# Altium schematic sheet IOExpander.SchDoc: I/O Expander
size Letter; ApprovedBy: Kevin Cotton; Author: Jessica Di Stefano; DrawnBy: Jessica Di Stefano; Revision: A; SheetNumber: 4; SheetTotal: 7
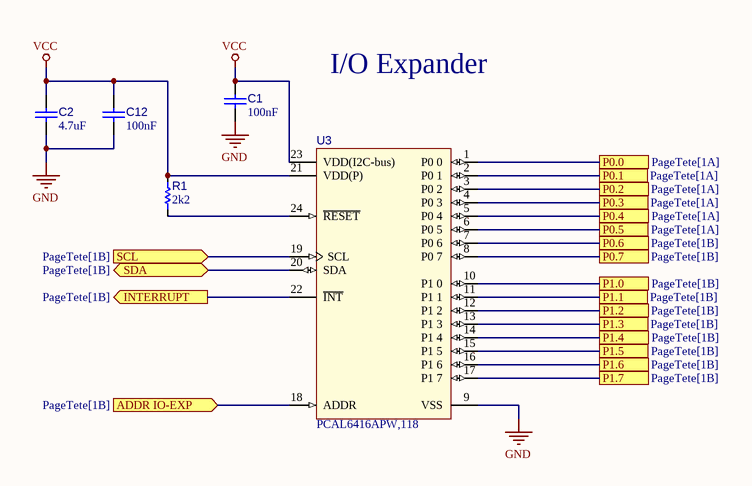
[diagram p0: IOExpander.SchDoc]

## Parts
C1  value 100nF  [C_1005[0402]]  (hidden comment: Cap 100nF 0402)
C2  value 4.7uF  [C_2012[0805]]  (hidden comment: Cap 4.7uF 0805)
C12  value 100nF  [C_1005[0402]]  (hidden comment: Cap 100nF 0402)
R1  value 2k2  [R_1005[0402]]  (hidden comment: Res 2k2 1% 0402)
U3  PCAL6416APW,118  [U_TSSOP24_SOT355-1-IPC_B]

## Ports
ADDR IO-EXP (in, see PageTete[1B]), INTERRUPT (out, see PageTete[1B]), P0.0 (see PageTete[1A]), P0.1 (see PageTete[1A]), P0.2 (see PageTete[1A]), P0.3 (see PageTete[1A]), P0.4 (see PageTete[1A]), P0.5 (see PageTete[1A]), P0.6 (see PageTete[1B]), P0.7 (see PageTete[1B]), P1.0 (see PageTete[1B]), P1.1 (see PageTete[1B]), P1.2 (see PageTete[1B]), P1.3 (see PageTete[1B]), P1.4 (see PageTete[1B]), P1.5 (see PageTete[1B]), P1.6 (see PageTete[1B]), P1.7 (see PageTete[1B]), SCL (in, see PageTete[1B]), SDA (bidir, see PageTete[1B])

## Nets
GND: C1.1 C2.1 C12.1 U3.9(VSS)
VCC: C1.2 C2.2 C12.2 R1.2 U3.21(VDD(P)) U3.23(VDD(I2C-bus))
ADDR IO-EXP: U3.18(ADDR) ; port ADDR IO-EXP
INTERRUPT: U3.22(~{INT}) ; port INTERRUPT
P0.0: U3.1(P0_0) ; port P0.0
P0.1: U3.2(P0_1) ; port P0.1
P0.2: U3.3(P0_2) ; port P0.2
P0.3: U3.4(P0_3) ; port P0.3
P0.4: U3.5(P0_4) ; port P0.4
P0.5: U3.6(P0_5) ; port P0.5
P0.6: U3.7(P0_6) ; port P0.6
P0.7: U3.8(P0_7) ; port P0.7
P1.0: U3.10(P1_0) ; port P1.0
P1.1: U3.11(P1_1) ; port P1.1
P1.2: U3.12(P1_2) ; port P1.2
P1.3: U3.13(P1_3) ; port P1.3
P1.4: U3.14(P1_4) ; port P1.4
P1.5: U3.15(P1_5) ; port P1.5
P1.6: U3.16(P1_6) ; port P1.6
P1.7: U3.17(P1_7) ; port P1.7
SCL: U3.19(SCL) ; port SCL
SDA: U3.20(SDA) ; port SDA
NetR1_1: R1.1 U3.24(~{RESET})

## Notes on the sheet
- I/O Expander
- Titre :
- Conception :
- Date :
- Approbation :
- Heure :
- Révision :
- Feuille
- de
- Fichier :

## Library data of the parts
C1 C12 = CAP001: Capacitor type 1; Manufacturer 1: Taiyo Yuden; Manufacturer Part Number 1: UMK105B7104KV-FR; CEGEP: KCOND01SM; Tolerance: 10%; Rated Voltage: 50V; Dielectric: X7R; LibRef: CAP001; Mount: SMT; Supplier 1: LCSC; Supplier Part Number 1: C2167491
C2 = CAP003: Capacitor type 1; Manufacturer 1: Taiyo Yuden; Manufacturer Part Number 1: TMK212AB7475KG-T; CEGEP: KCOND02SM; Tolerance: 10%; Rated Voltage: 25V; Dielectric: X7R; LibRef: CAP003; Mount: SMT; Supplier 1: LCSC; Supplier Part Number 1: C163186
R1 = RES008: Resistor type 1; Manufacturer 1: Yageo; Manufacturer Part Number 1: RC0402FR-072K2L; Puissance: 1/16W; Max Working Voltage: 50V; LibRef: RES008; Tolerance: 1%; Mount: SMT; Supplier 1: LCSC; Supplier Part Number 1: C114762; Supplier 2: Digi-Key; Supplier Part Number 2: 311-2.20KLRCT-ND
U3 = U_PCAL6416APW: IC I/O EXPANDER 16BIT 24TSSOP; Manufacturer Part Number 1: TCAL6416PWR; Manufacturer 1: Texas Instruments; Manufacturer 2: NXP Semiconductors; Manufacturer Part Number 2: PCAL6416APW,118; Mounting Technology: SMT; Supplier 1: LCSC; Supplier 2: LCSC; Supplier 3: Digikey; Supplier Part Number 1: C20345827; Supplier Part Number 2: C2652299; Supplier Part Number 3: 568-9922-1-ND